# EAGLE design encoder counter double (EAGLE 9.1.0)
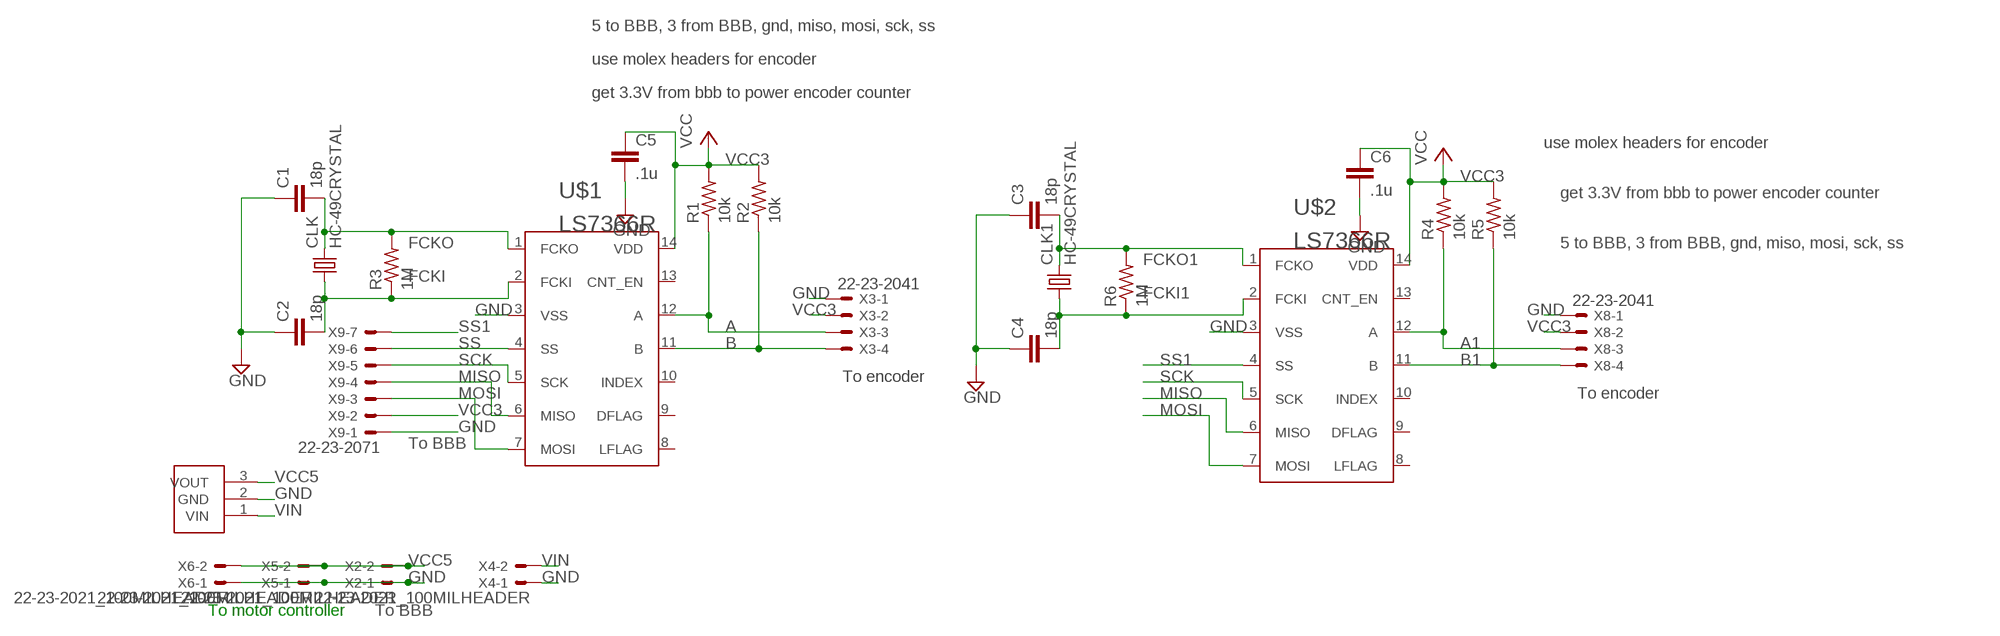
[diagram p0: schematic, sheet 1]

## Parts
C1  18p  C-EUC1206  [C1206]
C2  18p  C-EUC1206  [C1206]
C3  18p  C-EUC1206  [C1206]
C4  18p  C-EUC1206  [C1206]
C5  .1u  C-EUC1206  [C1206]
C6  .1u  C-EUC1206  [C1206]
CLK  HC-49CRYSTAL  [HC49/S]
CLK1  HC-49CRYSTAL  [HC49/S]
R1  10k  R-US_R1206  [R1206]
R2  10k  R-US_R1206  [R1206]
R3  1M  R-US_R1206  [R1206]
R4  10k  R-US_R1206  [R1206]
R5  10k  R-US_R1206  [R1206]
R6  1M  R-US_R1206  [R1206]
U$1  LS7366R  [SO14]
U$2  LS7366R  [SO14]
U$3  OKI-78SR-X_3PIN-DCDC  [MA03-1]
X2  22-23-2021_100MILHEADER  [22-23-2021_199MILHEADER]
X3  22-23-2041  [22-23-2041]
X4  22-23-2021_100MILHEADER  [22-23-2021_199MILHEADER]
X5  22-23-2021_100MILHEADER  [22-23-2021_199MILHEADER]
X6  22-23-2021_100MILHEADER  [22-23-2021_199MILHEADER]
X8  22-23-2041  [22-23-2041]
X9  22-23-2071  [22-23-2071]

## Nets
A: R1.1 U$1.12(A) X3.3
A1: R4.1 U$2.12(A) X8.3
B: R2.1 U$1.11(B) X3.4
B1: R5.1 U$2.11(B) X8.4
FCKI: C2.2 CLK.1 R3.1 U$1.2(FCKI)
FCKI1: C4.2 CLK1.1 R6.1 U$2.2(FCKI)
FCKO: C1.2 CLK.2 R3.2 U$1.1(FCKO)
FCKO1: C3.2 CLK1.2 R6.2 U$2.1(FCKO)
GND: C1.1 C2.1 C3.1 C4.1 C5.2 C6.2 U$1.3(VSS) U$2.3(VSS) U$3.2(GND) X2.1 X3.1 X4.1 X5.1 X6.1 X8.1 X9.1
MISO: U$1.6(MISO) U$2.6(MISO) X9.4
MOSI: U$1.7(MOSI) U$2.7(MOSI) X9.3
SCK: U$1.5(SCK) U$2.5(SCK) X9.5
SS: U$1.4(SS) X9.6
SS1: U$2.4(SS) X9.7
VCC3: C5.1 C6.1 R1.2 R2.2 R4.2 R5.2 U$1.14(VDD) U$2.14(VDD) X3.2 X8.2 X9.2 ; supply symbol labelled VCC
VCC5: U$3.3(VOUT) X2.2 X5.2 X6.2
VIN: U$3.1(VIN) X4.2
Unconnected: U$1.8(LFLAG) U$1.9(DFLAG) U$1.10(INDEX) U$1.13(CNT_EN) U$2.8(LFLAG) U$2.9(DFLAG) U$2.10(INDEX) U$2.13(CNT_EN)

## Notes on the sheet
- 5 to BBB, 3 from BBB, gnd, miso, mosi, sck, ss
- use molex headers for encoder
- get 3.3V from bbb to power encoder counter
- use molex headers for encoder
- get 3.3V from bbb to power encoder counter
- 5 to BBB, 3 from BBB, gnd, miso, mosi, sck, ss
- To encoder
- To encoder
- To BBB
- To motor controller | To BBB

## Library data of the parts
C1-C6 = rcl:C-EU: CAPACITOR, European symbol; SPICEPREFIX: C
CLK CLK1 = HuskyRobotics17-18:HC-49CRYSTAL
R1-R6 = rcl:R-US_: RESISTOR, American symbol; SPICEPREFIX: R
U$1 U$2 = HuskyRobotics17-18:LS7366R
U$3 = HuskyRobotics17-18:OKI-78SR-X_3PIN-DCDC
X2 X4-X6 = HuskyRobotics17-18:22-23-2021_100MILHEADER: .100" (2.54mm) Center Header - 2 Pin; MF: MOLEX; MPN: 22-23-2021; OC_FARNELL: 1462926; OC_NEWARK: 25C3832
X3 X8 = HuskyRobotics17-18:22-23-2041: .100" (2.54mm) Center Header - 4 Pin; MF: MOLEX; MPN: 22-23-2041; OC_FARNELL: 1462920; OC_NEWARK: 38C0355
X9 = con-molex:22-23-2071: .100" (2.54mm) Center Header - 7 Pin; MF: MOLEX; MPN: 22-23-2071; OC_FARNELL: 1654534; OC_NEWARK: 56H0445

## Board
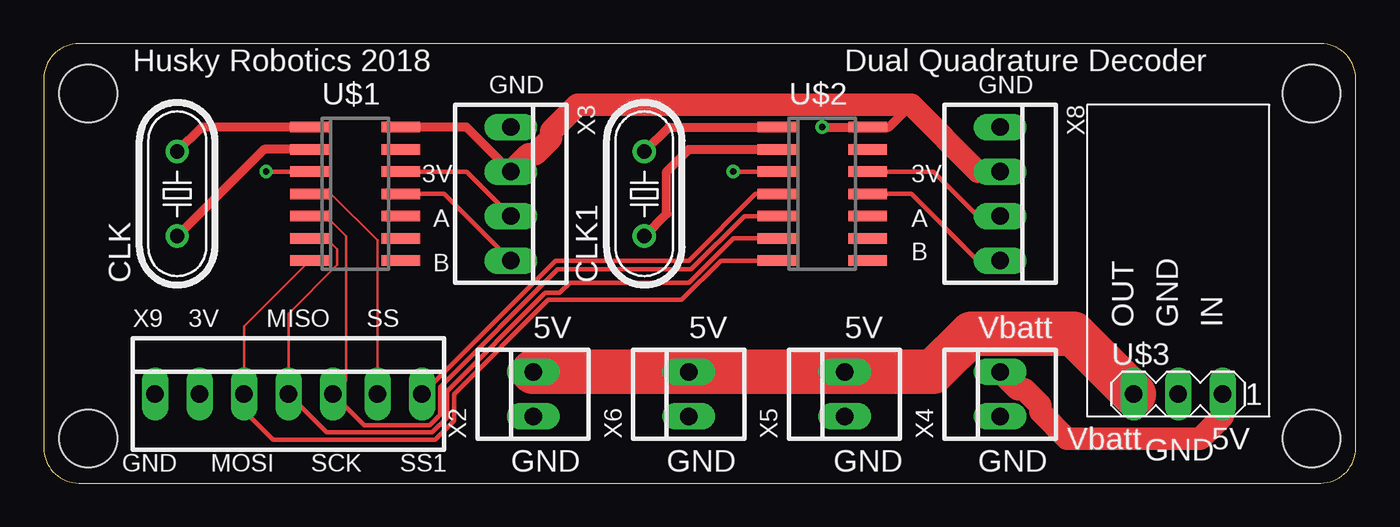
[diagram p1: board, top side]
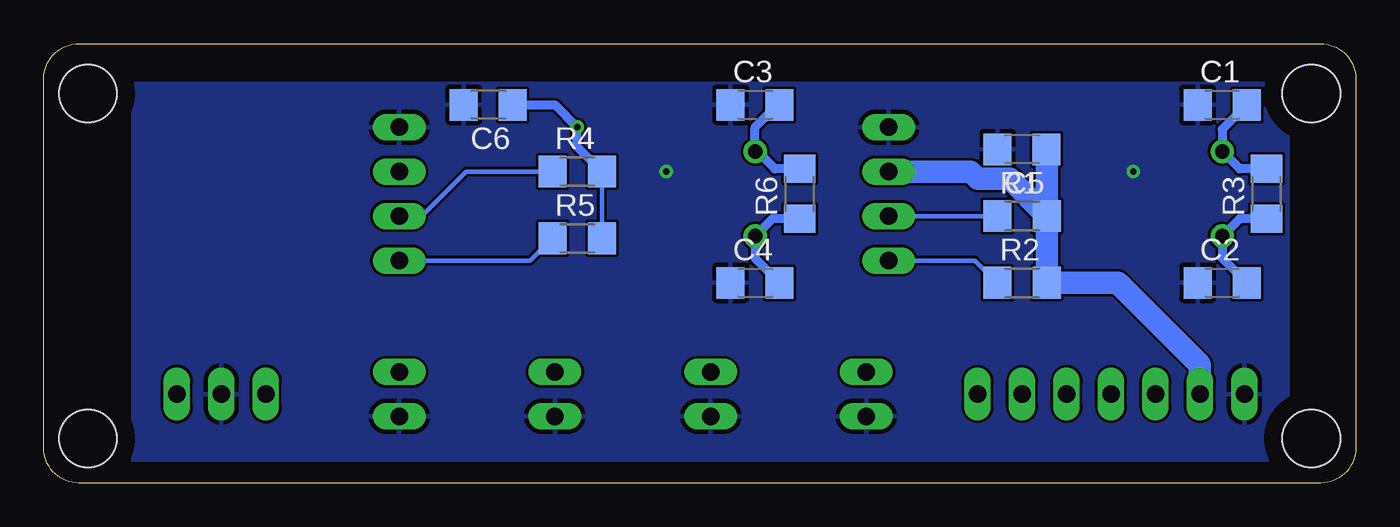
[diagram p2: board, bottom side, seen from below]

Size 74.91 x 25.07 mm. Coordinates in mm from the lower left corner, seen from the top.
Outline: 72.91,25.07 2,25.07 arc90 0,23.07 0,2 arc90 2,0 72.91,0 arc90 74.91,2 74.91,23.07 arc90 72.91,25.07
Copper layers (1*16): Top 0.035mm / dielectric 1.5mm / Bottom 0.035mm
Design rules "default": minimum track width 6mil, minimum drill 0.35mm, track to track 6mil, track to pad 6mil, pad to pad 6mil, via to via 6mil, smd to smd 6mil, copper to edge 40mil, drill to drill 6mil, minimum pad ring 10mil, minimum via ring 8mil, stop-mask expansion 4mil, vias tented up to drill 0mil, thermal gap 10mil
Holes 3.3 mm at 2.54,22.23 2.54,2.54 72.39,22.23 72.39,2.54

### Footprints (pad centres in the part's own frame; a part is rotated, then mirrored left to right if it is on the bottom)
C1206 = smd 1.6 x 1.8: 1 -1.4,0; 2 1.4,0
HC49/S = drill 0.813: 1 -2.413,0; 2 2.413,0
R1206 = smd 1.6 x 1.803: 1 -1.422,0; 2 1.422,0
SO14 = smd 0.6 x 2.2: 1 -3.81,-2.6; 2 -2.54,-2.6; 3 -1.27,-2.6; 4 0,-2.6; 5 1.27,-2.6; 6 2.54,-2.6; 7 3.81,-2.6; 8 3.81,2.6; 9 2.54,2.6; 10 1.27,2.6; 11 0,2.6; 12 -1.27,2.6; 13 -2.54,2.6; 14 -3.81,2.6
MA03-1 = drill 1.016 long: 1 2.54,0; 2 0,0; 3 -2.54,0
22-23-2021_199MILHEADER = drill 1 long: 1 -1.27,0; 2 1.27,0
22-23-2041 = drill 1 long: 1 -3.81,0; 2 -1.27,0; 3 1.27,0; 4 3.81,0
22-23-2071 = drill 1 long: 1 -7.62,0; 2 -5.08,0; 3 -2.54,0; 4 0,0; 5 2.54,0; 6 5.08,0; 7 7.62,0

### Placement (x,y rotation side)
C1  7.62,21.59 0 bottom
C2  7.62,11.43 0 bottom
C3  34.29,21.59 0 bottom
C4  34.29,11.43 0 bottom
C5  19.05,19.05 180 bottom
C6  49.53,21.59 180 bottom
CLK  7.62,16.51 90 top
CLK1  34.29,16.51 90 top
R1  19.05,15.24 0 bottom
R2  19.05,11.43 0 bottom
R3  5.08,16.51 90 bottom
R4  44.45,17.78 0 bottom
R5  44.45,13.97 0 bottom
R6  31.75,16.51 90 bottom
U$1  17.78,16.51 270 top
U$2  44.45,16.51 270 top
U$3  64.77,5.08 0 top
X2  27.94,5.08 90 top
X3  26.67,16.51 270 top
X4  54.61,5.08 90 top
X5  45.72,5.08 90 top
X6  36.83,5.08 90 top
X8  54.61,16.51 270 top
X9  13.97,5.08 0 top

### Tracks (layer width: path | path; a pad name or v marks a point on that pad's centre or on a via)
A
  Top 0.254: X3.3 24.13,17.78 U$1.12
  Bottom 0.254: R1.1 X3.3
A1
  Top 0.254: X8.3 53.34,15.24 50.8,17.78 U$2.12
  Bottom 0.254: R4.1 50.8,17.78 53.34,15.24 X8.3
B
  Top 0.254: X3.4 22.86,16.51 U$1.11
  Bottom 0.254: R2.1 21.74,12.7 X3.4
B1
  Top 0.254: U$2.11 49.53,16.51 53.34,12.7 X8.4
  Bottom 0.254: R5.1 47.14,12.7 X8.4
FCKI
  Top 0.508: U$1.2 12.57,19.05 CLK.1
  Bottom 0.508: R3.1 6.63,15.09 CLK.1 7.62,12.83 C2.2
FCKI1
  Top 0.508: CLK1.1 35.56,15.37 35.56,17.78 36.83,19.05 U$2.2
  Bottom 0.508: C4.2 34.29,12.83 CLK1.1 33.3,15.09 R6.1
FCKO
  Top 0.508: U$1.1 9.02,20.32 CLK.2
  Bottom 0.508: C1.2 7.62,20.19 CLK.2 6.63,17.93 R3.2
FCKO1
  Top 0.508: CLK1.2 35.69,20.32 U$2.1
  Bottom 0.508: R6.2 33.17,17.93 34.23,18.99 CLK1.2 34.29,20.32 33.02,21.59 C3.2
GND  (via drill 0.35)
  Top 0.254: U$1.3 v12.7,17.78 | U$2.3 v39.37,17.78
  pour Bottom: 3.81,22.86 3.81,1.27 69.85,1.27 69.85,22.86
MISO
  Top 0.152: X9.4 13.97,9.65 16.76,12.45 16.76,13.34 16.13,13.97 U$1.6
  Top 0.254: U$2.6 39.37,13.97 36.83,11.43 30.04,11.43 29.46,10.85 28.63,10.85 23.03,5.25 23.03,3.73 22.19,2.89 16.16,2.89 X9.4
MOSI
  Top 0.152: X9.3 11.43,8.95 U$1.7
  Top 0.254: X9.3 11.43,4.13 13.09,2.48 22.36,2.48 23.44,3.56 23.44,5.08 28.8,10.45 36.42,10.45 38.67,12.7 U$2.7
SCK
  Top 0.152: U$1.5 16.13,15.24 17.27,14.1 17.27,5.84 X9.5
  Top 0.254: U$2.5 40.01,15.24 36.96,12.19 29.34,12.19 22.62,5.48 22.62,3.9 22.02,3.29 18.3,3.29 X9.5
SS
  Top 0.152: X9.6 19.05,13.84 16.38,16.51 U$1.4
SS1
  Top 0.254: X9.7 29.21,12.7 36.83,12.7 40.64,16.51 U$2.4
VCC3  (via drill 0.35)
  Top 0.508: X3.2 24.13,20.32 U$1.14 | 49.53,21.59 48.26,20.32 U$2.14 v44.45,20.32
  Top 1.27: X3.2 27.67,18.78 28.06,18.78 28.96,19.68 28.96,20.07 30.48,21.59 49.53,21.59 53.34,17.78 X8.2
  Bottom 0.254: R5.2 R4.2
  Bottom 0.508: R4.2 44.45,19.2 v44.45,20.32 45.72,21.59 C6.1
  Bottom 1.27: R1.2 R2.2 13.58,11.43 8.89,6.74 X9.2 | R1.2 17.63,19.03 C5.1 | R1.2 19.75,17.36 21.58,17.36 21.99,17.78 X3.2
VCC5
  Top 2.54: X2.2 X6.2 X5.2 50.78,6.35 52.95,8.53 58.78,8.53 U$3.3
VIN
  Top 1.27: X4.2 55.61,5.35 56,5.35 56.91,4.45 56.91,4.05 58.42,2.54 66.04,2.54 67.31,3.81 U$3.1

### Text on the board
tPlace: Husky Robotics 2018 | Dual Quadrature Decoder | GND | GND | 3V | 3V | A | A | B | B | 3V | MISO | SS | 5V | 5V | 5V | Vbatt | Vbatt | 5V | GND | MOSI | SCK | SS1 | GND | GND | GND | GND | GND